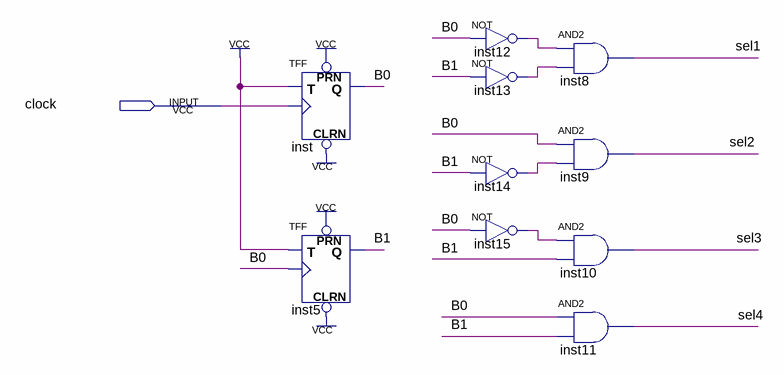
[diagram p0: schematic sheet]
// Quartus schematic seletor4.bdf as structural Verilog: 10 symbols, 1 pins
module seletor4 (
  input  clock
);

  wire B0, B1, inst12_out, inst13_out, inst14_out, inst15_out, sel1, sel2, sel3, sel4;

  TFF inst (.PRN(1'b1), .CLRN(1'b1), .T(1'b1), .CLK(clock), .Q(B0));
  TFF inst5 (.PRN(1'b1), .CLRN(1'b1), .T(1'b1), .CLK(B0), .Q(B1));
  not inst12 (inst12_out, B0);
  not inst13 (inst13_out, B1);
  not inst14 (inst14_out, B1);
  not inst15 (inst15_out, B0);
  and inst8 (sel1, inst12_out, inst13_out);
  and inst9 (sel2, B0, inst14_out);
  and inst10 (sel3, inst15_out, B1);
  and inst11 (sel4, B0, B1);
endmodule
